# Altium schematic sheet Main.SchDoc: =ProjectName
size A4; CheckedBy: DatNB; Author: Ven; CompanyName: Nacentech; Organization: IMET
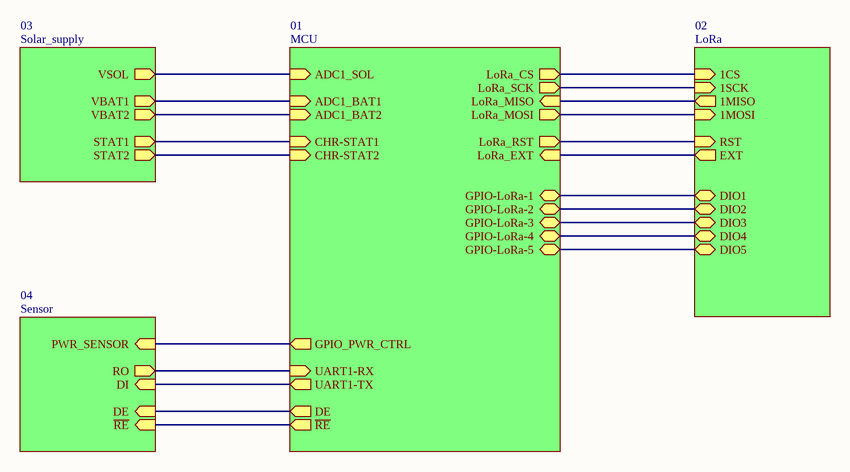
[diagram p0: Main.SchDoc]

## Sub-sheets
01 = MCU: LoRa_MOSI (out), LoRa_MISO (in), ADC1_SOL (in), GPIO-LoRa-3 (bidir), GPIO-LoRa-4 (bidir), CHR-STAT2 (in), CHR-STAT1 (in), DE (out), UART1-TX (out), GPIO-LoRa-1 (bidir), GPIO-LoRa-2 (bidir), ADC1_BAT2 (in), ADC1_BAT1 (in), LoRa_RST (out), LoRa_CS (out), LoRa_EXT (in), GPIO-LoRa-5 (bidir), UART1-RX (in), LoRa_SCK (out), GPIO_PWR_CTRL (out), ~{RE} (out)
02 = LoRa: 1CS (in), 1MOSI (in), EXT (out), 1MISO (out), 1SCK (in), RST (in), DIO4 (bidir), DIO5 (bidir), DIO1 (bidir), DIO3 (bidir), DIO2 (bidir)
03 = Solar_supply: VBAT2 (out), STAT1 (out), VBAT1 (out), VSOL (out), STAT2 (out)
04 = Sensor: ~{RE} (in), RO (out), DI (in), DE (in), PWR_SENSOR (in)

## Nets
(unnamed): sheet 03/VBAT2, sheet 01/ADC1_BAT2
(unnamed): sheet 03/STAT1, sheet 01/CHR-STAT1
(unnamed): sheet 03/VBAT1, sheet 01/ADC1_BAT1
(unnamed): sheet 03/VSOL, sheet 01/ADC1_SOL
(unnamed): sheet 03/STAT2, sheet 01/CHR-STAT2
(unnamed): sheet 01/LoRa_MOSI, sheet 02/1MOSI
(unnamed): sheet 01/LoRa_MISO, sheet 02/1MISO
(unnamed): sheet 01/GPIO-LoRa-3, sheet 02/DIO3
(unnamed): sheet 01/GPIO-LoRa-4, sheet 02/DIO4
(unnamed): sheet 01/DE, sheet 04/DE
(unnamed): sheet 01/UART1-TX, sheet 04/DI
(unnamed): sheet 01/GPIO-LoRa-1, sheet 02/DIO1
(unnamed): sheet 01/GPIO-LoRa-2, sheet 02/DIO2
(unnamed): sheet 01/LoRa_RST, sheet 02/RST
(unnamed): sheet 01/LoRa_CS, sheet 02/1CS
(unnamed): sheet 01/LoRa_EXT, sheet 02/EXT
(unnamed): sheet 01/GPIO-LoRa-5, sheet 02/DIO5
(unnamed): sheet 01/UART1-RX, sheet 04/RO
(unnamed): sheet 01/LoRa_SCK, sheet 02/1SCK
(unnamed): sheet 01/GPIO_PWR_CTRL, sheet 04/PWR_SENSOR
(unnamed): sheet 01/~{RE}, sheet 04/~{RE}

## Notes on the sheet
- Project:
- Page Contents:
- Size:
- Date:
- A4
- Checked by:
- Time:
- Revision:
- Sheet
- of
- File: